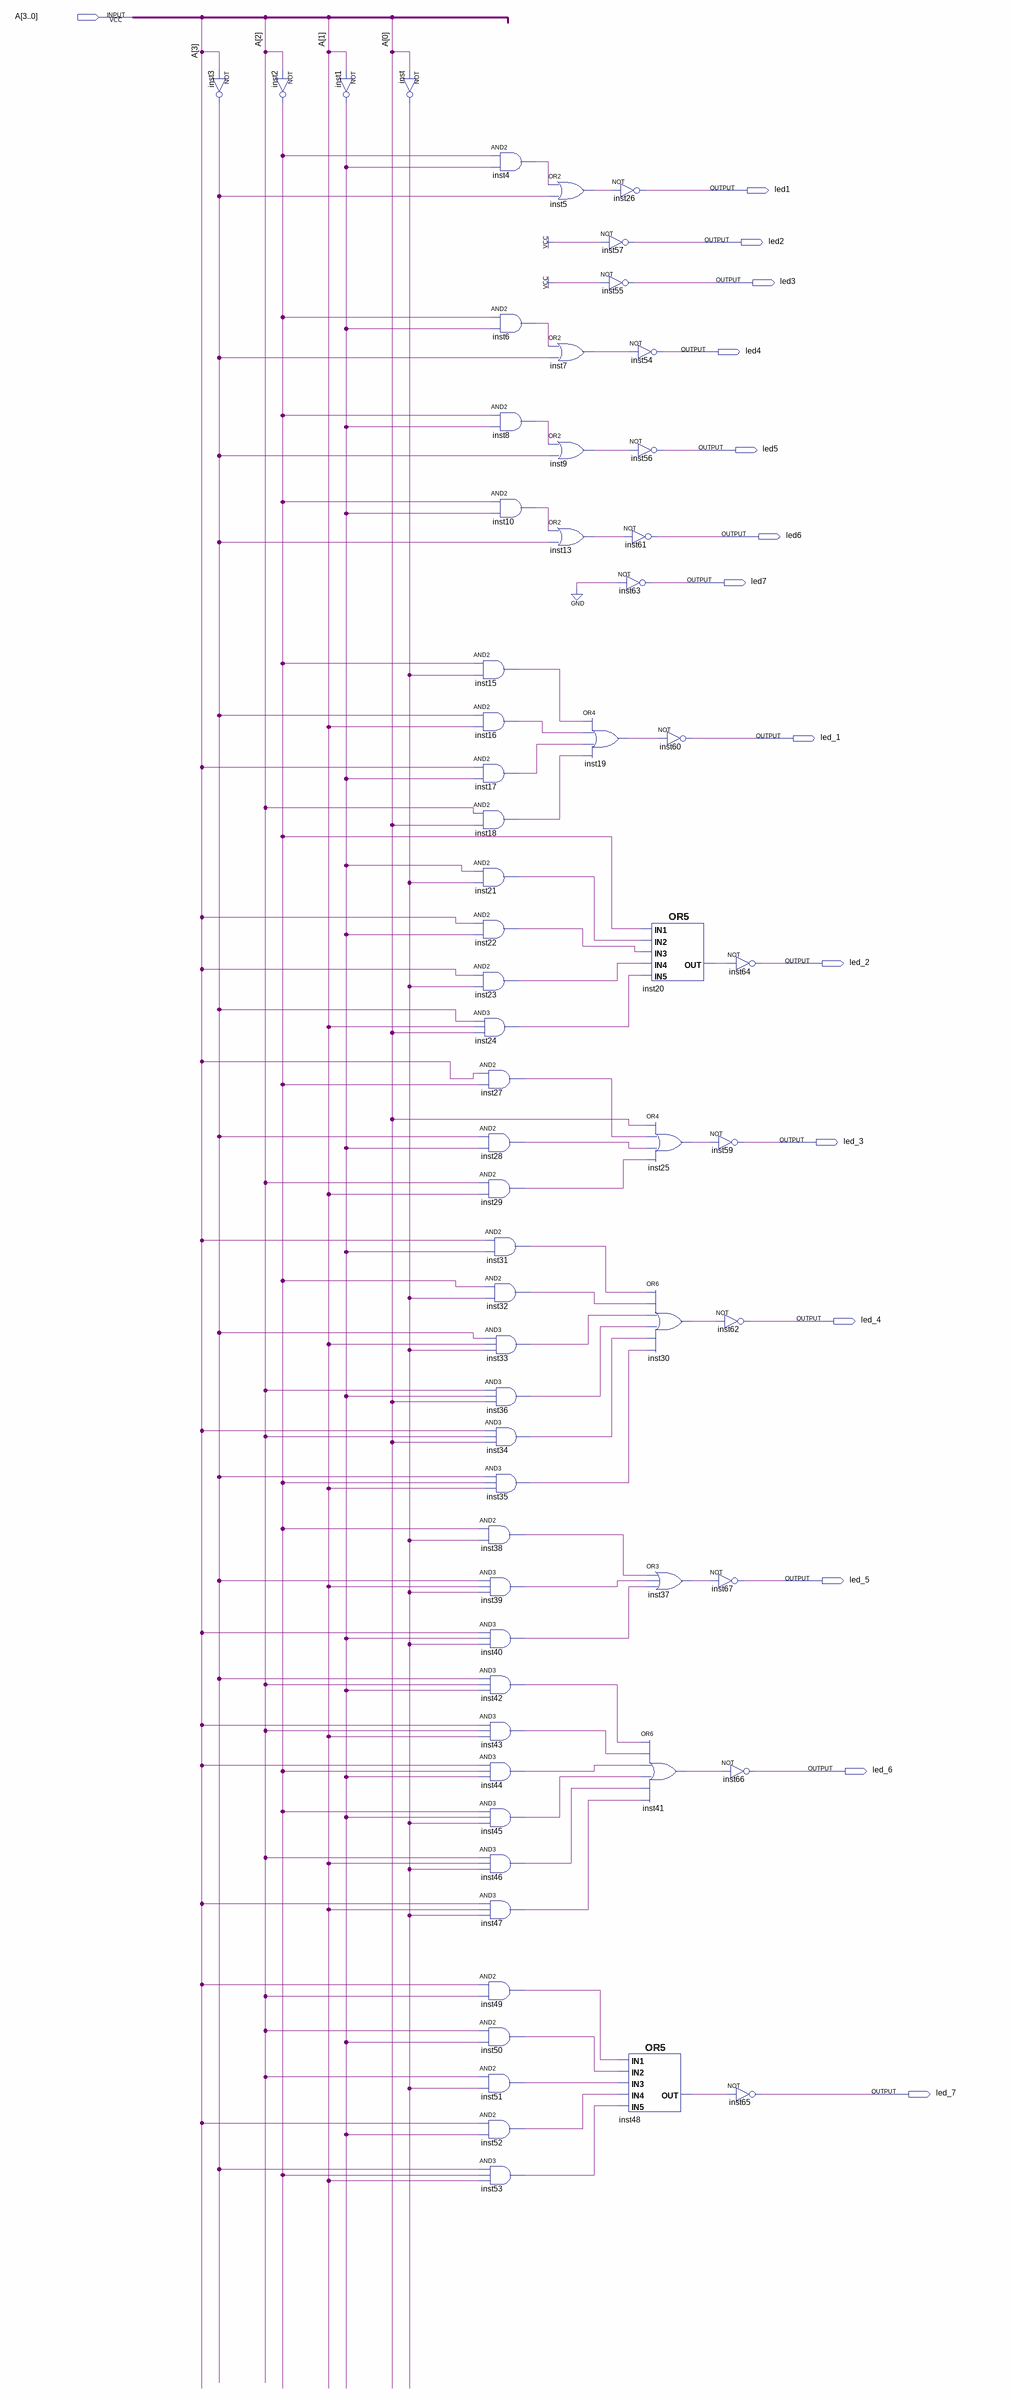
[diagram p0: schematic sheet]
// Quartus schematic Decodificador4bits.bdf as structural Verilog: 64 symbols, 15 pins
module Decodificador4bits (
  input  [3:0] A,
  output led1,
  output led2,
  output led3,
  output led4,
  output led5,
  output led6,
  output led7,
  output led_1,
  output led_2,
  output led_3,
  output led_4,
  output led_5,
  output led_6,
  output led_7
);

  wire inst1_out, inst2_out, inst3_out, inst4_out, inst5_out, inst6_out, inst7_out, inst8_out, inst9_out,
       inst10_out, inst13_out, inst15_out, inst16_out, inst17_out, inst18_out, inst19_out, inst20_out,
       inst21_out, inst22_out, inst23_out, inst24_out, inst25_out, inst27_out, inst28_out, inst29_out,
       inst30_out, inst31_out, inst32_out, inst33_out, inst34_out, inst35_out, inst36_out, inst37_out,
       inst38_out, inst39_out, inst40_out, inst41_out, inst42_out, inst43_out, inst44_out, inst45_out,
       inst46_out, inst47_out, inst48_out, inst49_out, inst50_out, inst51_out, inst52_out, inst53_out,
       inst_out;

  not inst3 (inst3_out, A[3]);
  not inst2 (inst2_out, A[2]);
  not inst1 (inst1_out, A[1]);
  not inst (inst_out, A[0]);
  and inst4 (inst4_out, inst2_out, inst1_out);
  and inst6 (inst6_out, inst2_out, inst1_out);
  and inst8 (inst8_out, inst2_out, inst1_out);
  and inst10 (inst10_out, inst2_out, inst1_out);
  and inst15 (inst15_out, inst2_out, inst_out);
  and inst16 (inst16_out, inst3_out, A[1]);
  and inst17 (inst17_out, A[3], inst1_out);
  and inst18 (inst18_out, A[2], A[0]);
  and inst21 (inst21_out, inst1_out, inst_out);
  and inst22 (inst22_out, A[3], inst1_out);
  and inst23 (inst23_out, A[3], inst_out);
  and inst24 (inst24_out, inst3_out, A[1], A[0]);
  and inst27 (inst27_out, A[3], inst2_out);
  and inst28 (inst28_out, inst3_out, inst1_out);
  and inst29 (inst29_out, A[2], A[1]);
  and inst31 (inst31_out, A[3], inst1_out);
  and inst32 (inst32_out, inst2_out, inst_out);
  and inst33 (inst33_out, inst3_out, A[1], inst_out);
  and inst36 (inst36_out, A[2], inst1_out, A[0]);
  and inst34 (inst34_out, A[3], A[2], A[0]);
  and inst35 (inst35_out, inst3_out, inst2_out, A[1]);
  and inst38 (inst38_out, inst2_out, inst_out);
  and inst39 (inst39_out, inst3_out, A[1], inst_out);
  and inst40 (inst40_out, A[3], inst1_out, inst_out);
  and inst42 (inst42_out, inst3_out, A[2], inst1_out);
  and inst43 (inst43_out, A[3], A[2], A[1]);
  and inst44 (inst44_out, A[3], inst2_out, inst1_out);
  and inst45 (inst45_out, inst2_out, inst1_out, inst_out);
  and inst46 (inst46_out, A[2], A[1], inst_out);
  and inst47 (inst47_out, A[3], A[1], inst_out);
  and inst49 (inst49_out, A[3], A[2]);
  and inst50 (inst50_out, A[2], inst1_out);
  and inst51 (inst51_out, A[2], inst_out);
  and inst52 (inst52_out, A[3], inst1_out);
  and inst53 (inst53_out, inst3_out, inst2_out, A[1]);
  or inst5 (inst5_out, inst4_out, inst3_out);
  or inst7 (inst7_out, inst6_out, inst3_out);
  or inst9 (inst9_out, inst8_out, inst3_out);
  or inst13 (inst13_out, inst10_out, inst3_out);
  not inst57 (led2, 1'b1);
  not inst55 (led3, 1'b1);
  or inst19 (inst19_out, inst15_out, inst16_out, inst17_out, inst18_out);
  not inst26 (led1, inst5_out);
  not inst54 (led4, inst7_out);
  not inst56 (led5, inst9_out);
  not inst61 (led6, inst13_out);
  not inst63 (led7, 1'b0);
  or inst20 (inst20_out, inst2_out, inst21_out, inst22_out, inst23_out, inst24_out);
  or inst25 (inst25_out, A[0], inst27_out, inst28_out, inst29_out);
  or inst30 (inst30_out, inst31_out, inst32_out, inst33_out, inst36_out, inst34_out, inst35_out);
  or inst37 (inst37_out, inst38_out, inst39_out, inst40_out);
  or inst41 (inst41_out, inst42_out, inst43_out, inst44_out, inst45_out, inst46_out, inst47_out);
  or inst48 (inst48_out, inst49_out, inst50_out, inst51_out, inst52_out, inst53_out);
  not inst60 (led_1, inst19_out);
  not inst64 (led_2, inst20_out);
  not inst59 (led_3, inst25_out);
  not inst62 (led_4, inst30_out);
  not inst67 (led_5, inst37_out);
  not inst66 (led_6, inst41_out);
  not inst65 (led_7, inst48_out);
endmodule
